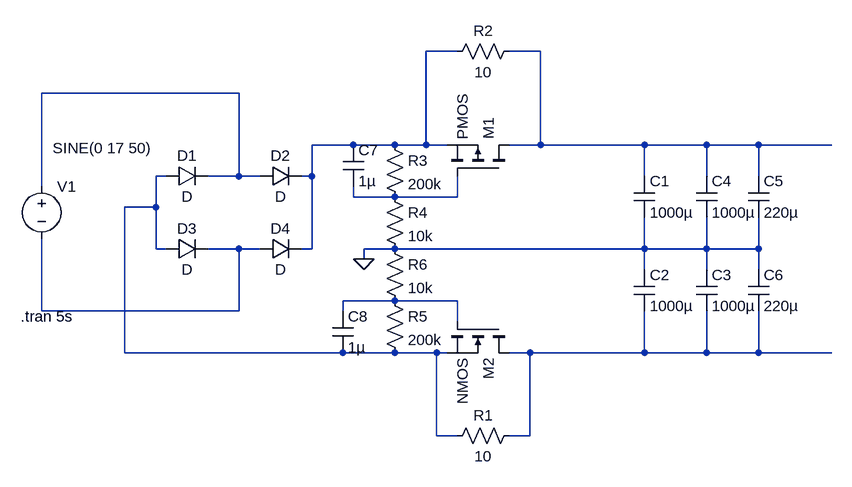
[diagram p0: schematic powersupply.asc]
powersupply.asc, the LTspice schematic file:
Version 4
SHEET 1 996 680
WIRE 272 -160 224 -160
WIRE 400 -160 352 -160
WIRE -64 -96 -368 -96
WIRE 112 -16 48 -16
WIRE 176 -16 112 -16
WIRE 224 -16 224 -160
WIRE 224 -16 176 -16
WIRE 256 -16 224 -16
WIRE 400 -16 400 -160
WIRE 400 -16 352 -16
WIRE 560 -16 400 -16
WIRE 656 -16 560 -16
WIRE 736 -16 656 -16
WIRE 848 -16 736 -16
WIRE -176 32 -192 32
WIRE -64 32 -64 -96
WIRE -64 32 -112 32
WIRE -32 32 -64 32
WIRE 48 32 48 -16
WIRE 48 32 32 32
WIRE 560 32 560 -16
WIRE 656 32 656 -16
WIRE 736 32 736 -16
WIRE -368 48 -368 -96
WIRE 112 64 112 48
WIRE 176 64 112 64
WIRE 272 64 272 32
WIRE 272 64 176 64
WIRE -192 80 -192 32
WIRE -192 80 -240 80
WIRE -192 144 -192 80
WIRE -176 144 -192 144
WIRE -64 144 -112 144
WIRE -32 144 -64 144
WIRE 48 144 48 32
WIRE 48 144 32 144
WIRE 176 144 128 144
WIRE 560 144 560 96
WIRE 560 144 176 144
WIRE 656 144 656 96
WIRE 656 144 560 144
WIRE 736 144 736 96
WIRE 736 144 656 144
WIRE 128 160 128 144
WIRE 560 176 560 144
WIRE 656 176 656 144
WIRE 736 176 736 144
WIRE 176 224 96 224
WIRE 272 224 176 224
WIRE -368 240 -368 128
WIRE -64 240 -64 144
WIRE -64 240 -368 240
WIRE 96 240 96 224
WIRE 272 256 272 224
WIRE -240 304 -240 80
WIRE 96 304 -240 304
WIRE 176 304 96 304
WIRE 240 304 176 304
WIRE 256 304 240 304
WIRE 384 304 352 304
WIRE 560 304 560 240
WIRE 560 304 384 304
WIRE 656 304 656 240
WIRE 656 304 560 304
WIRE 736 304 736 240
WIRE 736 304 656 304
WIRE 848 304 736 304
WIRE 240 432 240 304
WIRE 272 432 240 432
WIRE 384 432 384 304
WIRE 384 432 352 432
FLAG 128 160 0
SYMBOL diode -176 48 R270
WINDOW 0 32 32 VTop 2
WINDOW 3 0 32 VBottom 2
SYMATTR InstName D1
SYMBOL diode -32 48 R270
WINDOW 0 32 32 VTop 2
WINDOW 3 0 32 VBottom 2
SYMATTR InstName D2
SYMBOL diode -176 160 R270
WINDOW 0 32 32 VTop 2
WINDOW 3 0 32 VBottom 2
SYMATTR InstName D3
SYMBOL diode -32 160 R270
WINDOW 0 32 32 VTop 2
WINDOW 3 0 32 VBottom 2
SYMATTR InstName D4
SYMBOL voltage -368 32 R0
WINDOW 3 17 -43 Left 2
WINDOW 123 0 0 Left 0
WINDOW 39 0 0 Left 0
SYMATTR InstName V1
SYMATTR Value SINE(0 17 50)
SYMBOL cap 544 32 R0
SYMATTR InstName C1
SYMATTR Value 1000µ
SYMBOL cap 640 32 R0
SYMATTR InstName C4
SYMATTR Value 1000µ
SYMBOL cap 720 32 R0
SYMATTR InstName C5
SYMATTR Value 220µ
SYMBOL res 368 -176 R90
WINDOW 0 0 56 VBottom 2
WINDOW 3 32 56 VTop 2
SYMATTR InstName R2
SYMATTR Value 10
SYMBOL pmos 352 32 M270
SYMATTR InstName M1
SYMBOL res 160 -32 R0
SYMATTR InstName R3
SYMATTR Value 200k
SYMBOL res 160 48 R0
SYMATTR InstName R4
SYMATTR Value 10k
SYMBOL cap 96 -16 R0
SYMATTR InstName C7
SYMATTR Value 1µ
SYMBOL nmos 352 256 R90
SYMATTR InstName M2
SYMBOL cap 544 176 R0
SYMATTR InstName C2
SYMATTR Value 1000µ
SYMBOL cap 640 176 R0
SYMATTR InstName C3
SYMATTR Value 1000µ
SYMBOL cap 720 176 R0
SYMATTR InstName C6
SYMATTR Value 220µ
SYMBOL res 368 416 R90
WINDOW 0 0 56 VBottom 2
WINDOW 3 32 56 VTop 2
SYMATTR InstName R1
SYMATTR Value 10
SYMBOL res 160 208 R0
SYMATTR InstName R5
SYMATTR Value 200k
SYMBOL res 160 128 R0
SYMATTR InstName R6
SYMATTR Value 10k
SYMBOL cap 80 240 R0
SYMATTR InstName C8
SYMATTR Value 1µ
TEXT -400 248 Left 2 !.tran 5s

The netlist it stands for:
* powersupply.asc
D1 N004 N003 D
D2 N003 N001 D
D3 N004 N006 D
D4 N006 N001 D
V1 N003 N006 SINE(0 17 50)
C1 N002 0 1000µ
C4 N002 0 1000µ
C5 N002 0 220µ
R2 N002 N001 10
M1 N002 N005 N001 N001 PMOS
R3 N001 N005 200k
R4 N005 0 10k
C7 N001 N005 1µ
M2 N008 N007 N004 N004 NMOS
C2 0 N008 1000µ
C3 0 N008 1000µ
C6 0 N008 220µ
R1 N008 N004 10
R5 N007 N004 200k
R6 0 N007 10k
C8 N007 N004 1µ
.model D D
.lib standard.dio
.model NMOS NMOS
.model PMOS PMOS
.lib standard.mos
.tran 5s
.backanno
.end